# EAGLE schematic vdac (EAGLE 8.1.1)

## Sheet 1 of 4
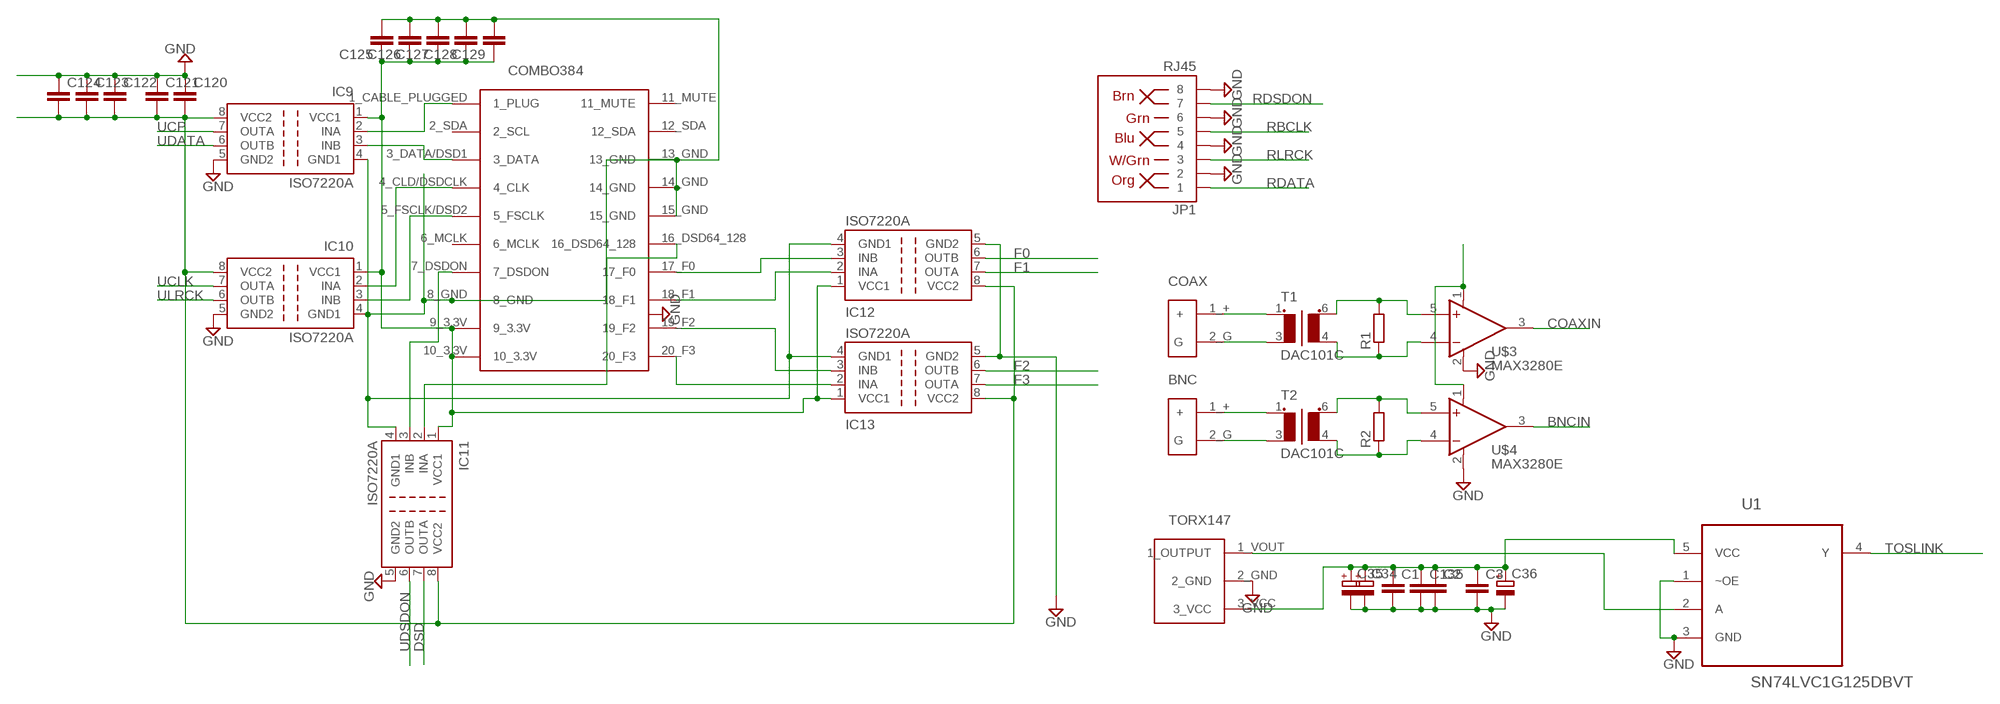
[diagram p0: schematic, sheet 1]

### Parts
BNC  RCA  [RCA]
C1  C-EUC0805  [C0805]
C2  C-EUC0805  [C0805]
C3  C-EUC0805  [C0805]
C34  CPOL-EUSP-CAP-CX  [SP-CAP-CX]
C35  CPOL-EUSP-CAP-CX  [SP-CAP-CX]
C36  CPOL-EUSP-CAP-CX  [SP-CAP-CX]
C120  C-EUC0805  [C0805]
C121  C-EUC0805  [C0805]
C122  C-EUC0805  [C0805]
C123  C-EUC0805  [C0805]
C124  C-EUC0805  [C0805]
C125  C-EUC0805  [C0805]
C126  C-EUC0805  [C0805]
C127  C-EUC0805  [C0805]
C128  C-EUC0805  [C0805]
C129  C-EUC0805  [C0805]
C135  C-EUC0805  [C0805]
COAX  RCA  [RCA]
IC9  ISO7220A  [SO-08]
IC10  ISO7220A  [SO-08]
IC11  ISO7220A  [SO-08]
IC12  ISO7220A  [SO-08]
IC13  ISO7220A  [SO-08]
JP1  RJ45  RJ45-8PTH  [RJ45-8]
R1  R-EU_MELF0204W  [MINI_MELF-0204W]
R2  R-EU_MELF0204W  [MINI_MELF-0204W]
T1  DAC101C  [DAC101]
T2  DAC101C  [DAC101]
U1  SN74LVC1G125DBVT  [SOT95P280X145-5N]
U$1  COMBO384  [COMBO384]
U$2  TORX147  [TORX147]
U$3  MAX3280E  [SOT23-5L]
U$4  MAX3280E  [SOT23-5L]

### Nets
BNCIN: U$4.3(OUT) ; also sheet 3
COAXIN: U$3.3(OUT) ; also sheet 3
DSD: IC11.7(OUTA) ; also sheet 3
F0: IC12.6(OUTB) ; also sheet 3
F1: IC12.7(OUTA) ; also sheet 3
F2: IC13.6(OUTB) ; also sheet 3
F3: IC13.7(OUTA) ; also sheet 3
GND: C1.2 C2.2 C3.2 C34.- C35.- C36.- C120.1 C121.1 C122.1 C123.1 C124.1 C135.2 IC9.5(GND2) IC10.5(GND2) IC11.5(GND2) IC12.5(GND2) IC13.5(GND2) JP1.2 JP1.4 JP1.6 JP1.8 U1.1(~OE) U1.3(GND) U$2.2_GND U$3.2(V-) U$4.2(V-) ; also sheet 2,3,4
I3V3: C1.1 C2.1 C3.1 C34.+ C35.+ C36.+ C120.2 C121.2 C122.2 C123.2 C124.2 C135.1 IC9.8(VCC2) IC10.8(VCC2) IC11.8(VCC2) IC12.8(VCC2) IC13.8(VCC2) U1.5(VCC) U$2.3_VCC U$3.1(V+) U$4.1(V+) ; also sheet 3
N$1: COAX.1_+(+) T1.1
N$2: COAX.2_G(G) T1.3(P2)
N$3: BNC.1_+(+) T2.1
N$4: BNC.2_G(G) T2.3(P2)
N$5: R1.2 T1.6(S1) U$3.5(+IN)
N$6: R1.1 T1.4(S2) U$3.4(-IN)
N$7: R2.2 T2.6(S1) U$4.5(+IN)
N$8: R2.1 T2.4(S2) U$4.4(-IN)
N$86: U1.2(A) U$2.1_VOUT(1_OUTPUT)
N$90: IC9.2(INA) U$1.1_CABLE_PLUGGED(1_PLUG)
N$93: IC9.3(INB) U$1.3_DATA/DSD1(3_DATA)
N$94: IC10.2(INA) U$1.4_CLD/DSDCLK(4_CLK)
N$95: IC10.3(INB) U$1.5_FSCLK/DSD2(5_FSCLK)
N$97: IC11.3(INB) U$1.7_DSDON
N$98: C125.1 C126.1 C127.1 C128.1 C129.1 IC9.1(VCC1) IC10.1(VCC1) IC11.1(VCC1) IC12.1(VCC1) IC13.1(VCC1) U$1.9_3.3V U$1.10_3.3V
N$99: IC11.2(INA) U$1.16_DSD64_128
N$100: IC12.3(INB) U$1.17_F0
N$101: IC12.2(INA) U$1.18_F1
N$102: IC13.3(INB) U$1.19_F2
N$103: IC13.2(INA) U$1.20_F3
RBCLK: JP1.5 ; also sheet 3
RDATA: JP1.1 ; also sheet 3
RDSDON: JP1.7 ; also sheet 3
RLRCK: JP1.3 ; also sheet 3
TOSLINK: U1.4(Y) ; also sheet 3
UCLK: IC10.7(OUTA) ; also sheet 3
UCP: IC9.7(OUTA)
UDATA: IC9.6(OUTB) ; also sheet 3
UDSDON: IC11.6(OUTB) ; also sheet 3
UGND: C125.2 C126.2 C127.2 C128.2 C129.2 IC9.4(GND1) IC10.4(GND1) IC11.4(GND1) IC12.4(GND1) IC13.4(GND1) U$1.8_GND U$1.13_GND U$1.14_GND U$1.15_GND
ULRCK: IC10.6(OUTB) ; also sheet 3
Unconnected: U$1.2_SDA(2_SCL) U$1.6_MCLK U$1.11_MUTE U$1.12_SDA

## Sheet 2 of 4
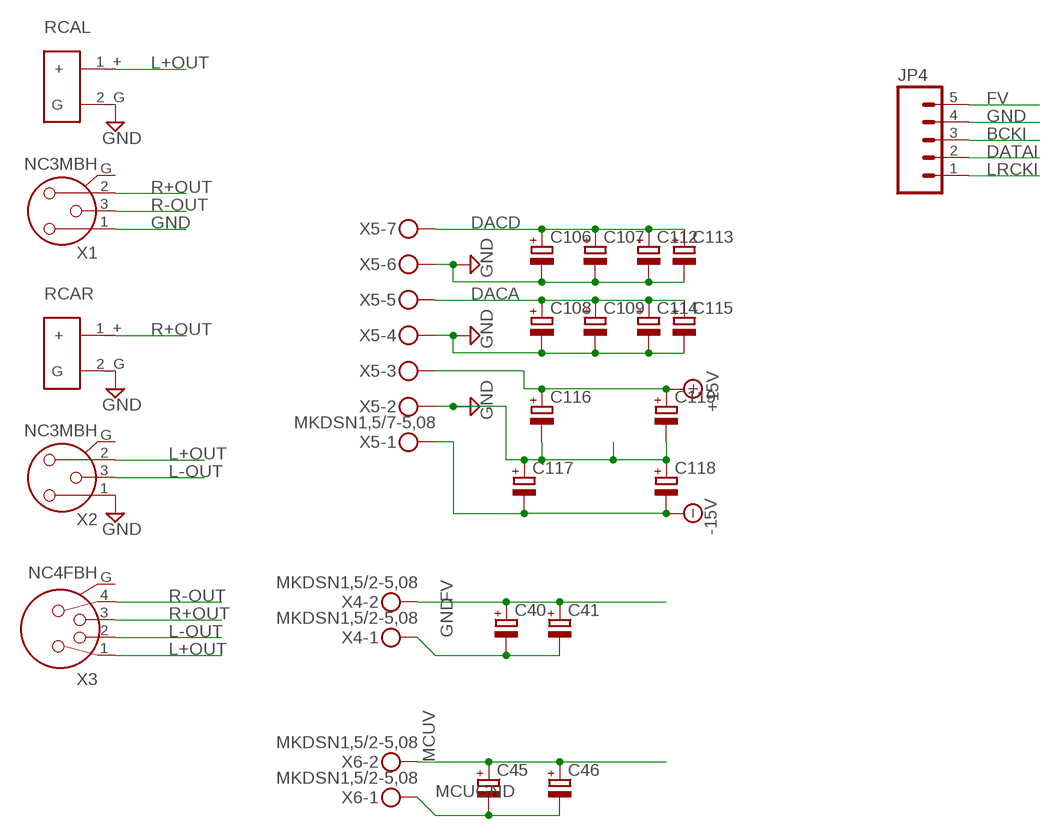
[diagram p1: schematic, sheet 2]

### Parts
C40  CPOL-EUSP-CAP-CX  [SP-CAP-CX]
C41  CPOL-EUSP-CAP-CX  [SP-CAP-CX]
C45  CPOL-EUSP-CAP-CX  [SP-CAP-CX]
C46  CPOL-EUSP-CAP-CX  [SP-CAP-CX]
C106  CPOL-EUSP-CAP-CX  [SP-CAP-CX]
C107  CPOL-EUSP-CAP-CX  [SP-CAP-CX]
C108  CPOL-EUSP-CAP-CX  [SP-CAP-CX]
C109  CPOL-EUSP-CAP-CX  [SP-CAP-CX]
C112  CPOL-EUSP-CAP-CX  [SP-CAP-CX]
C113  CPOL-EUSP-CAP-CX  [SP-CAP-CX]
C114  CPOL-EUSP-CAP-CX  [SP-CAP-CX]
C115  CPOL-EUSP-CAP-CX  [SP-CAP-CX]
C116  CPOL-EUSP-CAP-CX  [SP-CAP-CX]
C117  CPOL-EUSP-CAP-CX  [SP-CAP-CX]
C118  CPOL-EUSP-CAP-CX  [SP-CAP-CX]
C119  CPOL-EUSP-CAP-CX  [SP-CAP-CX]
JP4  M05PTH_LONGPADS  [1X05_LONGPADS]
RCAL  RCA  [RCA]
RCAR  RCA  [RCA]
X1  NC3MBH  [NC3MBH]
X2  NC3MBH  [NC3MBH]
X3  NC4FBH  [NC4FBH]
X4  MKDSN1,5/2-5,08  [MKDSN1,5/2-5,08]
X5  MKDSN1,5/7-5,08  [MKDSN1,5/7-5,08]
X6  MKDSN1,5/2-5,08  [MKDSN1,5/2-5,08]

### Nets
+15V: C116.+ C119.+ X5.3 ; also sheet 4
-15V: C117.- C118.- X5.1 ; also sheet 4
BCKI: JP4.3 ; also sheet 3
DACA: C108.+ C109.+ C114.+ C115.+ X5.5 ; also sheet 4
DACD: C106.+ C107.+ C112.+ C113.+ X5.7 ; also sheet 4
DATAI: JP4.2 ; also sheet 3
FV: C40.+ C41.+ JP4.5 X4.2 ; also sheet 3,4
GND: C40.- C41.- C106.- C107.- C108.- C109.- C112.- C113.- C114.- C115.- C116.- C117.+ C118.+ C119.- JP4.4 RCAL.2_G(G) RCAR.2_G(G) X1.1 X2.1 X4.1 X5.2 X5.4 X5.6 ; also sheet 1,3,4
L+OUT: RCAL.1_+(+) X2.2 X3.1 ; also sheet 4
L-OUT: X2.3 X3.2 ; also sheet 4
LRCKI: JP4.1 ; also sheet 3
MCUGND: C45.- C46.- X6.1 ; also sheet 3
MCUV: C45.+ C46.+ X6.2 ; also sheet 3
R+OUT: RCAR.1_+(+) X1.2 X3.3 ; also sheet 4
R-OUT: X1.3 X3.4 ; also sheet 4
Unconnected: X1.G X2.G X3.G

## Sheet 3 of 4
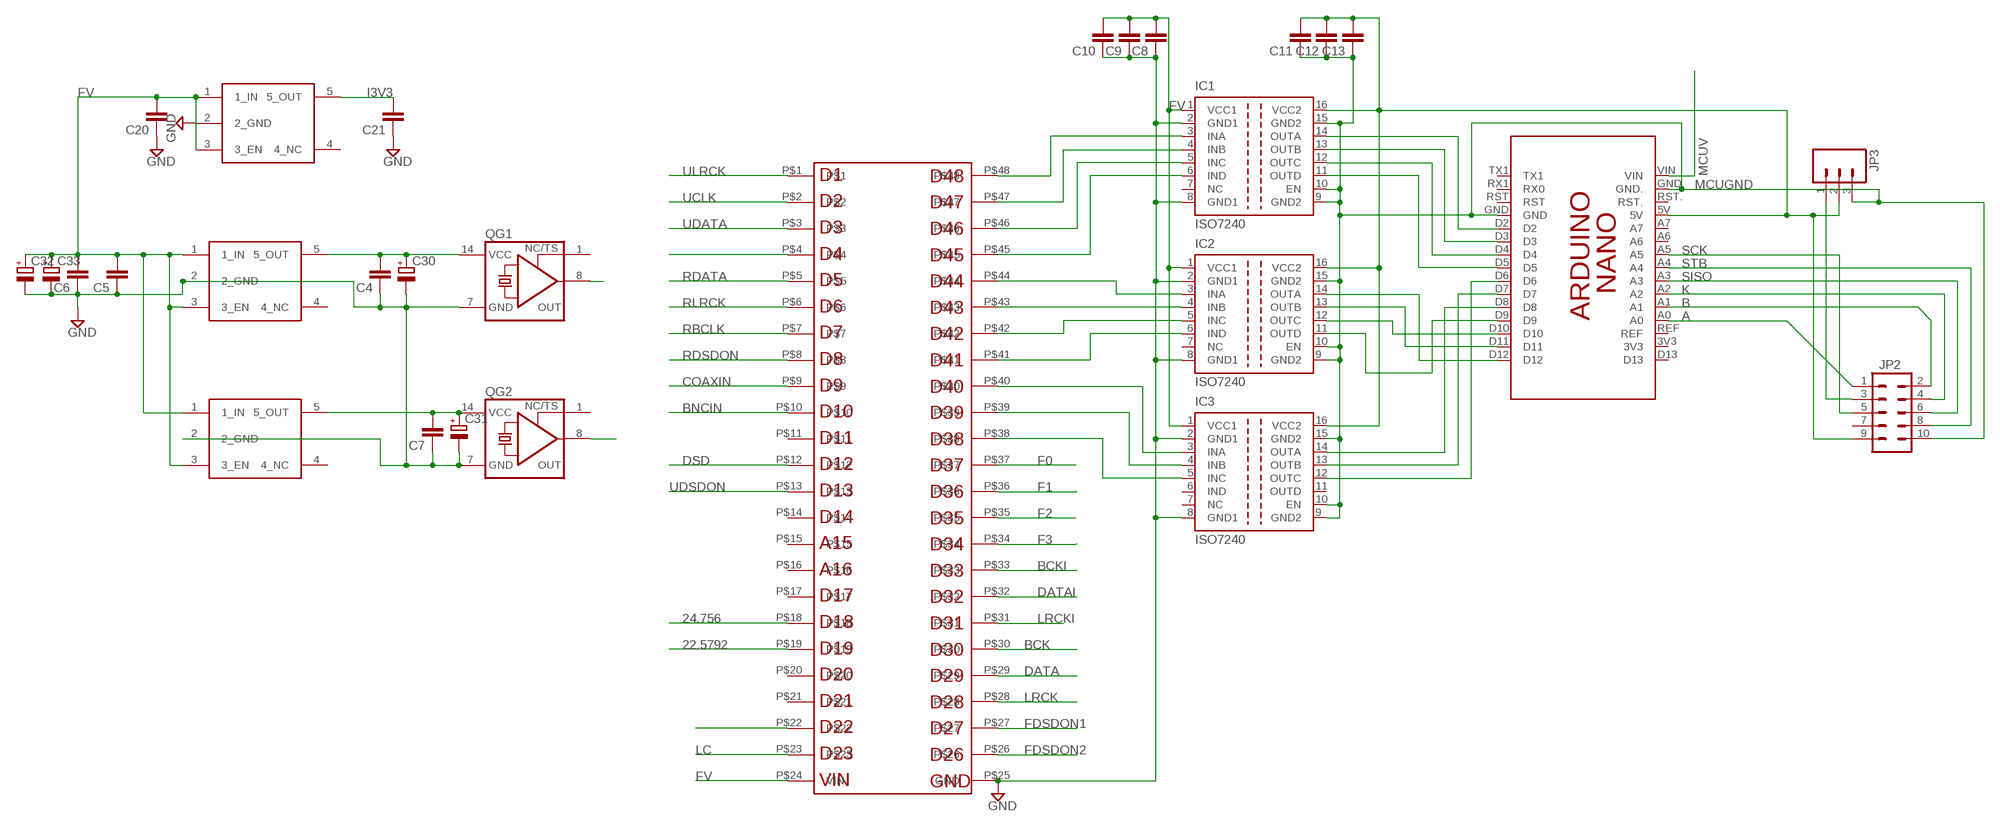
[diagram p2: schematic, sheet 3]

### Parts
C4  C-EUC0805  [C0805]
C5  C-EUC0805  [C0805]
C6  C-EUC0805  [C0805]
C7  C-EUC0805  [C0805]
C8  C-EUC0805  [C0805]
C9  C-EUC0805  [C0805]
C10  C-EUC0805  [C0805]
C11  C-EUC0805  [C0805]
C12  C-EUC0805  [C0805]
C13  C-EUC0805  [C0805]
C20  C-EUC0805  [C0805]
C21  C-EUC0805  [C0805]
C30  CPOL-EUSP-CAP-CX  [SP-CAP-CX]
C31  CPOL-EUSP-CAP-CX  [SP-CAP-CX]
C32  CPOL-EUSP-CAP-CX  [SP-CAP-CX]
C33  CPOL-EUSP-CAP-CX  [SP-CAP-CX]
IC1  ISO7240  [SO-16DW]
IC2  ISO7240  [SO-16DW]
IC3  ISO7240  [SO-16DW]
JP2  M05X2SHD  [2X5-SHROUDED]
JP3  M03JST-PTH-VERT  [JST-3-PTH-VERT]
PCB1  ARDUINO_NANO  [ARDUINO_NANO]
QG1  XO-14  [DIL14S]
QG2  XO-14  [DIL14S]
U$10  LP5907  [SOT-23-5]
U$12  CMOD-A7  [CMODA7]
U$15  LP5907  [SOT-23-5]
U$16  LP5907  [SOT-23-5]

### Nets
22.5792: QG2.8(OUT) U$12.P$19
24.756: QG1.8(OUT) U$12.P$18
A: JP2.1 PCB1.A0
B: JP2.2 PCB1.A1
BCK: U$12.P$30 ; also sheet 4
BCKI: U$12.P$33 ; also sheet 2
BNCIN: U$12.P$10 ; also sheet 1
COAXIN: U$12.P$9 ; also sheet 1
D2: IC1.14(OUTA) PCB1.D2
D3: IC1.13(OUTB) PCB1.D3
D4: IC1.12(OUTC) PCB1.D4
D5: IC1.11(OUTD) PCB1.D5
DATA: U$12.P$29 ; also sheet 4
DATAI: U$12.P$32 ; also sheet 2
DSD: U$12.P$12 ; also sheet 1
F0: U$12.P$37 ; also sheet 1
F1: U$12.P$36 ; also sheet 1
F2: U$12.P$35 ; also sheet 1
F3: U$12.P$34 ; also sheet 1
FDSDON1: U$12.P$27 ; also sheet 4
FDSDON2: U$12.P$26 ; also sheet 4
FV: C5.2 C6.2 C8.2 C9.2 C10.2 C20.2 C32.+ C33.+ IC1.1(VCC1) IC2.1(VCC1) IC3.1(VCC1) U$10.1(1_IN) U$10.3(3_EN) U$12.P$24(VIN) U$15.1(1_IN) U$15.3(3_EN) U$16.1(1_IN) U$16.3(3_EN) ; also sheet 2,4
GND: C4.1 C5.1 C6.1 C7.1 C8.1 C9.1 C10.1 C20.1 C21.1 C30.- C31.- C32.- C33.- IC1.2(GND1) IC1.8(GND1) IC2.2(GND1) IC2.8(GND1) IC3.2(GND1) IC3.8(GND1) QG1.7(GND) QG2.7(GND) U$10.2(2_GND) U$12.P$25(GND) U$15.2(2_GND) U$16.2(2_GND) ; also sheet 1,2,4
I3V3: C21.2 U$10.5(5_OUT) ; also sheet 1
K: JP2.4 PCB1.A2
LC: U$12.P$23 ; also sheet 4
LRCK: U$12.P$28 ; also sheet 4
LRCKI: U$12.P$31 ; also sheet 2
MCUGND: C11.1 C12.1 C13.1 IC1.9(GND2) IC1.10(EN) IC1.15(GND2) IC2.9(GND2) IC2.10(EN) IC2.15(GND2) IC3.9(GND2) IC3.10(EN) IC3.15(GND2) JP2.10 JP3.3 PCB1.GND PCB1.GND. ; also sheet 2
MCUV: PCB1.VIN ; also sheet 2
N$25: C4.2 C30.+ QG1.14(VCC) U$15.5(5_OUT)
N$27: C7.2 C31.+ QG2.14(VCC) U$16.5(5_OUT)
N$32: IC1.3(INA) U$12.P$48
N$33: IC1.4(INB) U$12.P$47
N$35: IC1.5(INC) U$12.P$46
N$36: IC1.6(IND) U$12.P$45
N$39: IC2.3(INA) U$12.P$44
N$40: IC2.4(INB) U$12.P$43
N$42: IC2.5(INC) U$12.P$42
N$43: IC2.6(IND) U$12.P$41
N$44: IC3.3(INA) U$12.P$40
N$45: IC3.4(INB) U$12.P$39
N$46: IC3.5(INC) U$12.P$38
N$51: IC2.14(OUTA) PCB1.D12
N$52: IC2.13(OUTB) PCB1.D11
N$53: IC2.12(OUTC) PCB1.D10
N$54: IC2.11(OUTD) PCB1.D9
N$55: IC3.14(OUTA) PCB1.D8
N$56: IC3.13(OUTB) PCB1.D7
N$57: IC3.12(OUTC) PCB1.D6
N$91: C11.2 C12.2 C13.2 IC1.16(VCC2) IC2.16(VCC2) IC3.16(VCC2) JP2.9 JP3.2 PCB1.5V
N$92: JP2.3 JP3.1
RBCLK: U$12.P$7 ; also sheet 1
RC: U$12.P$22 ; also sheet 4
RDATA: U$12.P$5 ; also sheet 1
RDSDON: U$12.P$8 ; also sheet 1
RLRCK: U$12.P$6 ; also sheet 1
SCK: JP2.5 PCB1.A5
SISO: JP2.6 PCB1.A3
STB: JP2.8 PCB1.A4
TOSLINK: U$12.P$4 ; also sheet 1
UCLK: U$12.P$2 ; also sheet 1
UDATA: U$12.P$3 ; also sheet 1
UDSDON: U$12.P$13 ; also sheet 1
ULRCK: U$12.P$1 ; also sheet 1
Unconnected: IC1.7(NC) IC2.7(NC) IC3.6(IND) IC3.7(NC) IC3.11(OUTD) JP2.7 PCB1.3V3 PCB1.A6 PCB1.A7 PCB1.D13 PCB1.REF PCB1.RST PCB1.RST. PCB1.RX1(RX0) PCB1.TX1 QG1.1(TS) QG2.1(TS) U$10.4(4_NC) U$12.P$11 U$12.P$14 U$12.P$15 U$12.P$16 U$12.P$17 U$12.P$20 U$12.P$21 U$15.4(4_NC) U$16.4(4_NC)

## Sheet 4 of 4
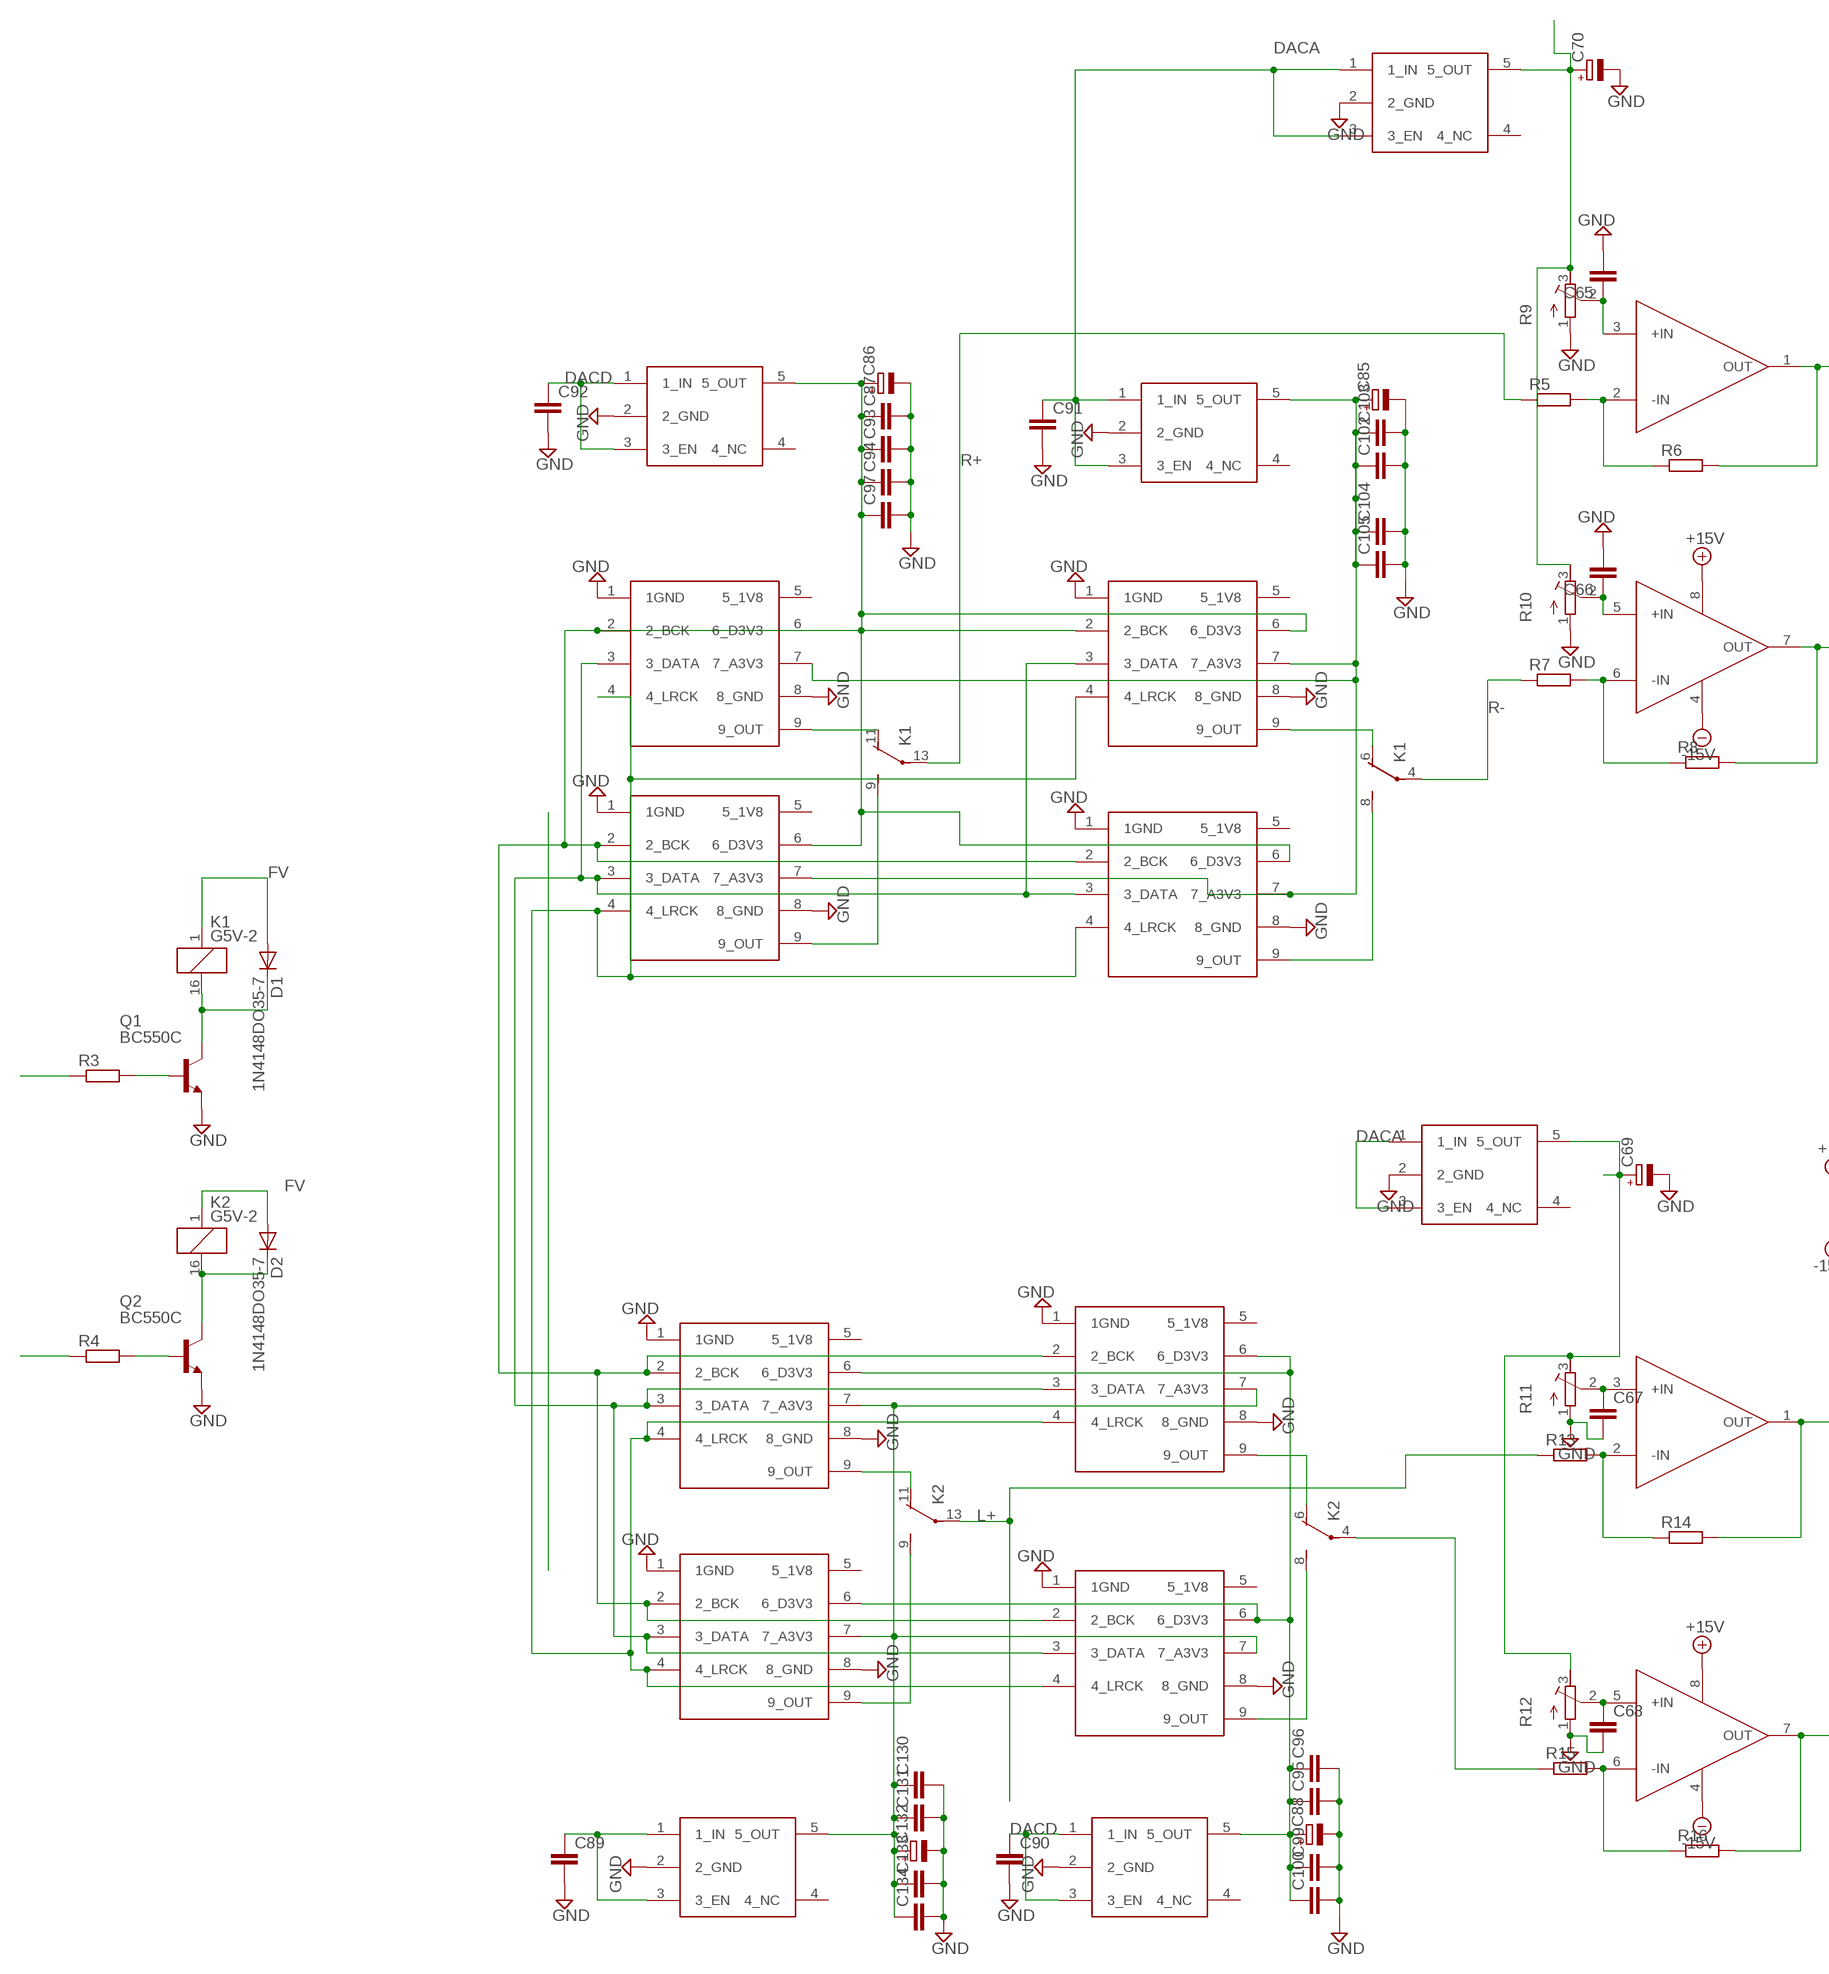
[diagram p3: schematic, sheet 4, part 1 of 2]
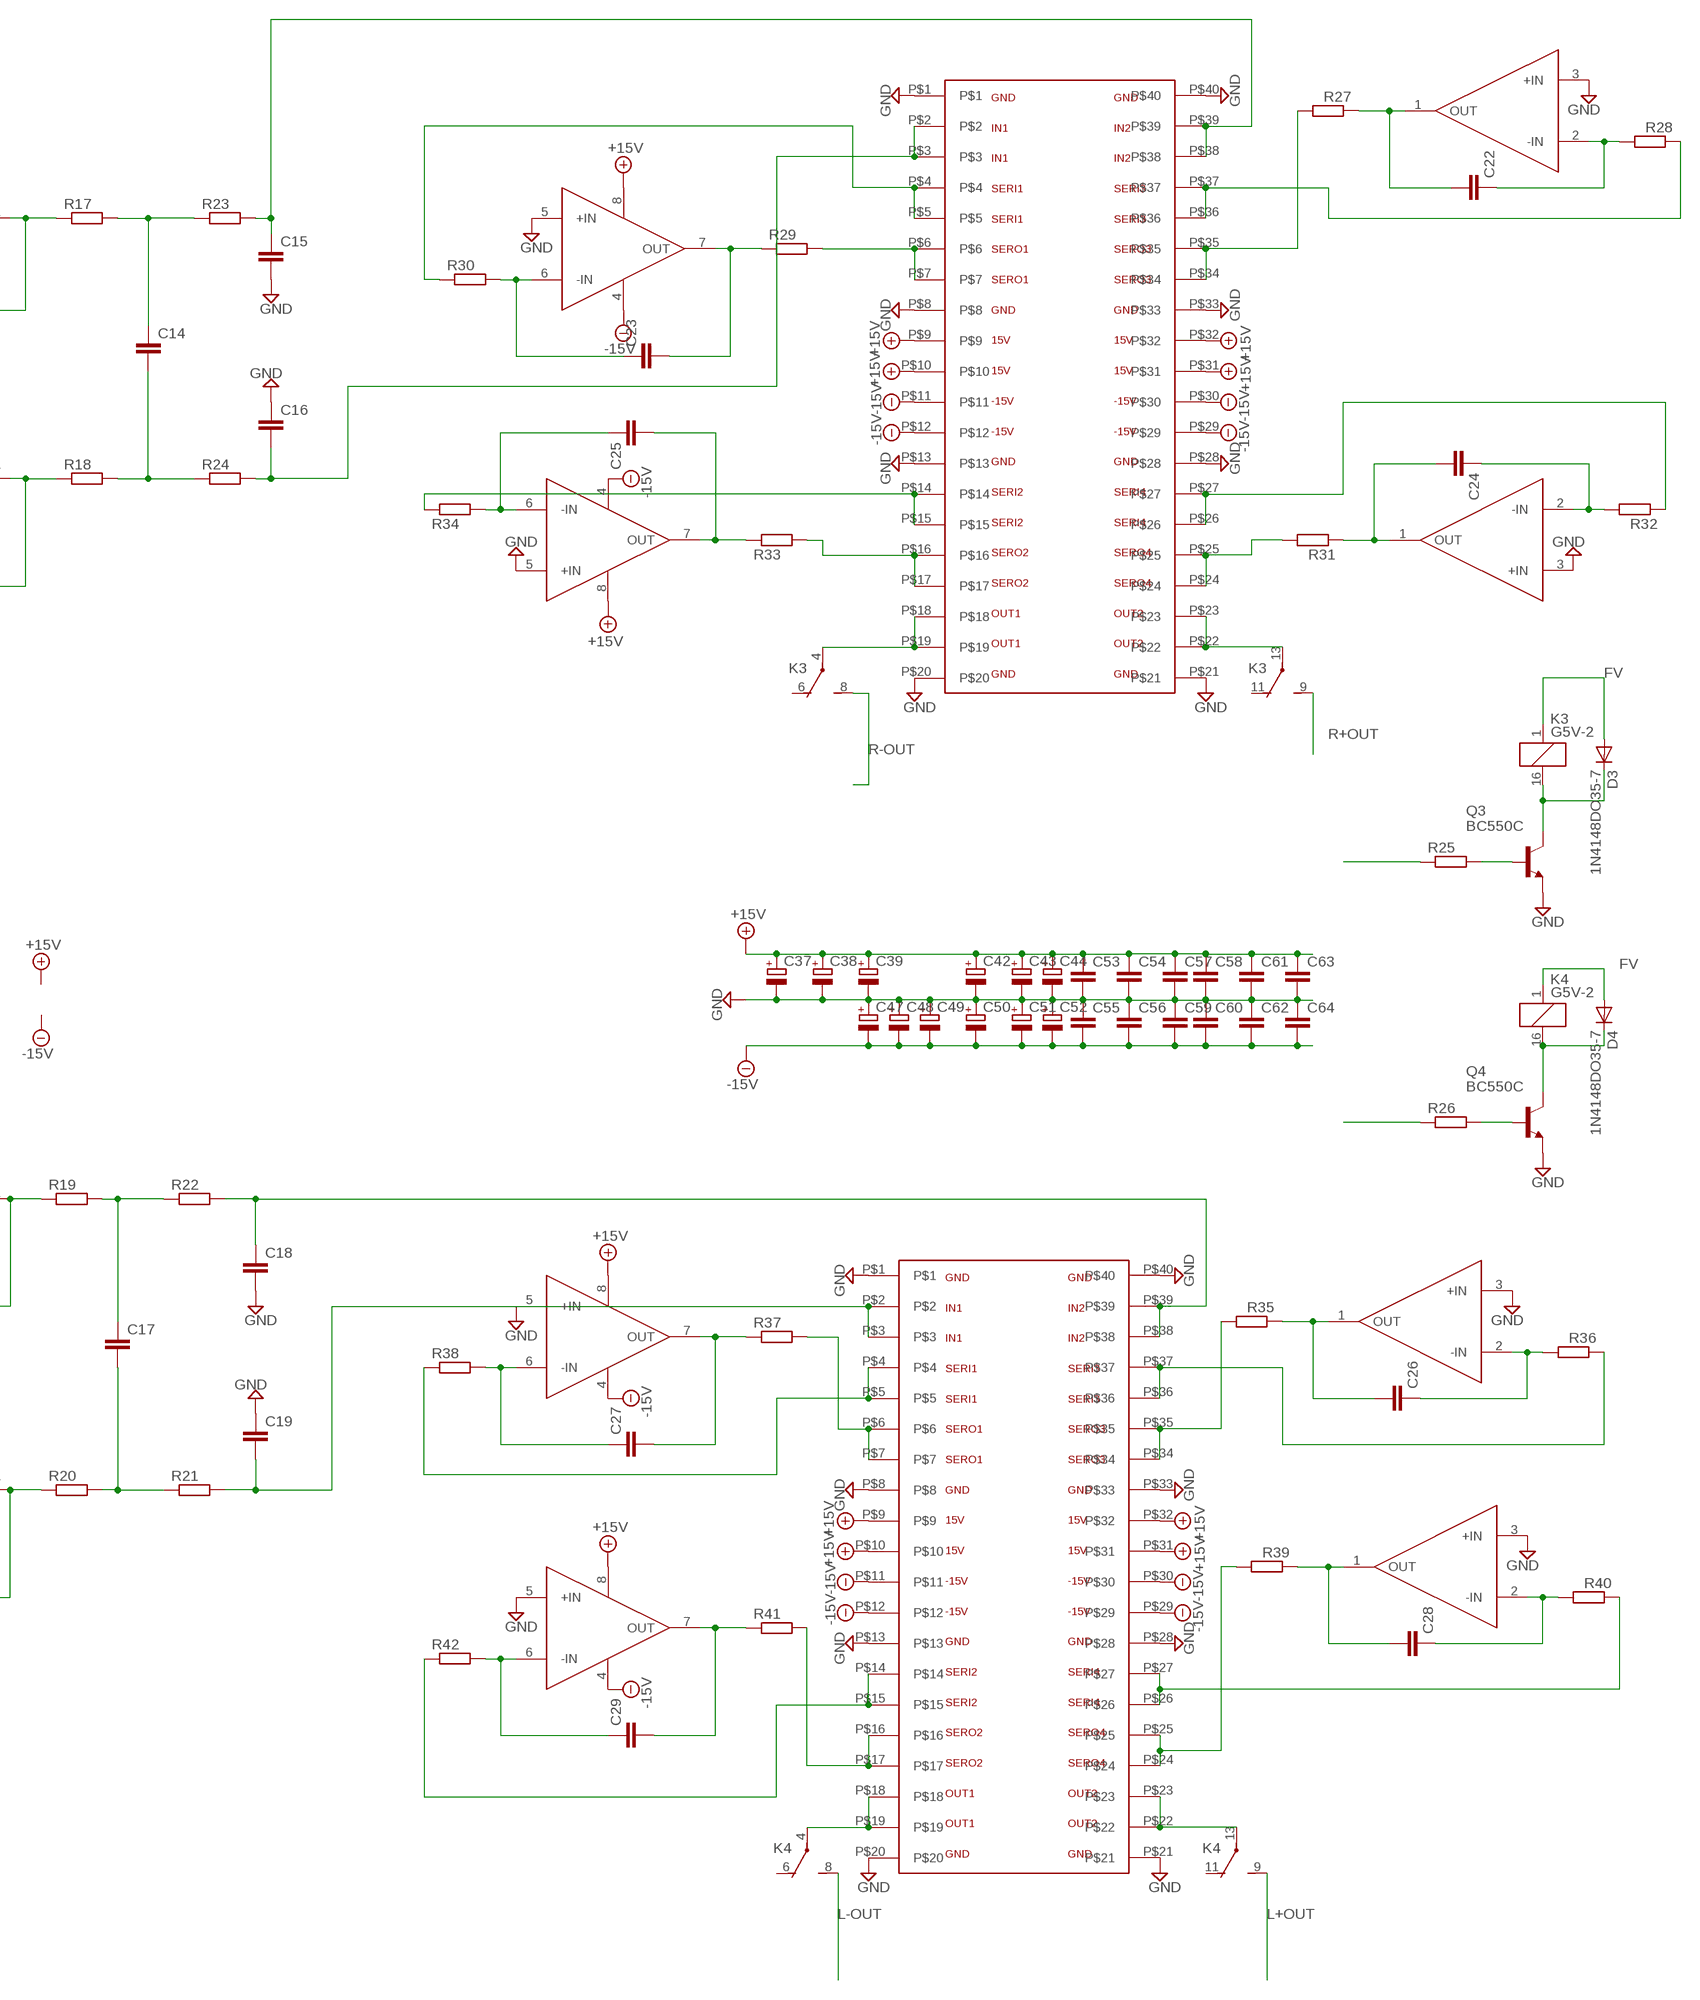
[diagram p4: schematic, sheet 4, part 2 of 2]

### Parts
C14  C-EUC0805  [C0805]
C15  C-EUC0805  [C0805]
C16  C-EUC0805  [C0805]
C17  C-EUC0805  [C0805]
C18  C-EUC0805  [C0805]
C19  C-EUC0805  [C0805]
C22  C-EUC1210  [C1210]
C23  C-EUC1210  [C1210]
C24  C-EUC1210  [C1210]
C25  C-EUC1210  [C1210]
C26  C-EUC1210  [C1210]
C27  C-EUC1210  [C1210]
C28  C-EUC1210  [C1210]
C29  C-EUC1210  [C1210]
C37  CPOL-EUSP-CAP-CX  [SP-CAP-CX]
C38  CPOL-EUSP-CAP-CX  [SP-CAP-CX]
C39  CPOL-EUSP-CAP-CX  [SP-CAP-CX]
C42  CPOL-EUSP-CAP-CX  [SP-CAP-CX]
C43  CPOL-EUSP-CAP-CX  [SP-CAP-CX]
C44  CPOL-EUSP-CAP-CX  [SP-CAP-CX]
C47  CPOL-EUSP-CAP-CX  [SP-CAP-CX]
C48  CPOL-EUSP-CAP-CX  [SP-CAP-CX]
C49  CPOL-EUSP-CAP-CX  [SP-CAP-CX]
C50  CPOL-EUSP-CAP-CX  [SP-CAP-CX]
C51  CPOL-EUSP-CAP-CX  [SP-CAP-CX]
C52  CPOL-EUSP-CAP-CX  [SP-CAP-CX]
C53  C-EUC1206  [C1206]
C54  C-EUC1206  [C1206]
C55  C-EUC1206  [C1206]
C56  C-EUC1206  [C1206]
C57  C-EUC1206  [C1206]
C58  C-EUC1206  [C1206]
C59  C-EUC1206  [C1206]
C60  C-EUC1206  [C1206]
C61  C-EUC1206  [C1206]
C62  C-EUC1206  [C1206]
C63  C-EUC1206  [C1206]
C64  C-EUC1206  [C1206]
C65  C-EUC1210  [C1210]
C66  C-EUC1210  [C1210]
C67  C-EUC1210  [C1210]
C68  C-EUC1210  [C1210]
C69  CPOL-EUSP-CAP-CX  [SP-CAP-CX]
C70  CPOL-EUSP-CAP-CX  [SP-CAP-CX]
C85  CPOL-EUSP-CAP-CX  [SP-CAP-CX]
C86  CPOL-EUSP-CAP-CX  [SP-CAP-CX]
C87  C-EUC1210  [C1210]
C88  CPOL-EUSP-CAP-CX  [SP-CAP-CX]
C89  C-EUC1210  [C1210]
C90  C-EUC1210  [C1210]
C91  C-EUC1210  [C1210]
C92  C-EUC1210  [C1210]
C93  C-EUC1210  [C1210]
C94  C-EUC1210  [C1210]
C95  C-EUC1210  [C1210]
C96  C-EUC1210  [C1210]
C97  C-EUC1210  [C1210]
C99  C-EUC1210  [C1210]
C100  C-EUC1210  [C1210]
C102  C-EUC1210  [C1210]
C103  C-EUC1210  [C1210]
C104  C-EUC1210  [C1210]
C105  C-EUC1210  [C1210]
C130  C-EUC1210  [C1210]
C131  C-EUC1210  [C1210]
C132  CPOL-EUSP-CAP-CX  [SP-CAP-CX]
C133  C-EUC1210  [C1210]
C134  C-EUC1210  [C1210]
D1  1N4148DO35-7  [DO35-7]
D2  1N4148DO35-7  [DO35-7]
D3  1N4148DO35-7  [DO35-7]
D4  1N4148DO35-7  [DO35-7]
DSDL+  R2R  [R2R]
DSDL-  R2R  [R2R]
DSDR+  R2R  [R2R]
DSDR-  R2R  [R2R]
K1  G5V-2  [G5V-2]
K2  G5V-2  [G5V-2]
K3  G5V-2  [G5V-2]
K4  G5V-2  [G5V-2]
L+  R2R  [R2R]
L-  R2R  [R2R]
Q1  BC550C  [TO92-EBC]
Q2  BC550C  [TO92-EBC]
Q3  BC550C  [TO92-EBC]
Q4  BC550C  [TO92-EBC]
R3  R-EU_MELF0204W  [MINI_MELF-0204W]
R4  R-EU_MELF0204W  [MINI_MELF-0204W]
R5  R-EU_MELF0204W  [MINI_MELF-0204W]
R6  R-EU_MELF0204W  [MINI_MELF-0204W]
R7  R-EU_MELF0204W  [MINI_MELF-0204W]
R8  R-EU_MELF0204W  [MINI_MELF-0204W]
R9  R-TRIMM3296W  [RTRIM3296W]
R10  R-TRIMM3296W  [RTRIM3296W]
R11  R-TRIMM3296W  [RTRIM3296W]
R12  R-TRIMM3296W  [RTRIM3296W]
R13  R-EU_MELF0204W  [MINI_MELF-0204W]
R14  R-EU_MELF0204W  [MINI_MELF-0204W]
R15  R-EU_MELF0204W  [MINI_MELF-0204W]
R16  R-EU_MELF0204W  [MINI_MELF-0204W]
R17  R-EU_MELF0204W  [MINI_MELF-0204W]
R18  R-EU_MELF0204W  [MINI_MELF-0204W]
R19  R-EU_MELF0204W  [MINI_MELF-0204W]
R20  R-EU_MELF0204W  [MINI_MELF-0204W]
R21  R-EU_MELF0204W  [MINI_MELF-0204W]
R22  R-EU_MELF0204W  [MINI_MELF-0204W]
R23  R-EU_MELF0204W  [MINI_MELF-0204W]
R24  R-EU_MELF0204W  [MINI_MELF-0204W]
R25  R-EU_MELF0204W  [MINI_MELF-0204W]
R26  R-EU_MELF0204W  [MINI_MELF-0204W]
R27  R-EU_MELF0204W  [MINI_MELF-0204W]
R28  R-EU_MELF0204W  [MINI_MELF-0204W]
R29  R-EU_MELF0204W  [MINI_MELF-0204W]
R30  R-EU_MELF0204W  [MINI_MELF-0204W]
R31  R-EU_MELF0204W  [MINI_MELF-0204W]
R32  R-EU_MELF0204W  [MINI_MELF-0204W]
R33  R-EU_MELF0204W  [MINI_MELF-0204W]
R34  R-EU_MELF0204W  [MINI_MELF-0204W]
R35  R-EU_MELF0204W  [MINI_MELF-0204W]
R36  R-EU_MELF0204W  [MINI_MELF-0204W]
R37  R-EU_MELF0204W  [MINI_MELF-0204W]
R38  R-EU_MELF0204W  [MINI_MELF-0204W]
R39  R-EU_MELF0204W  [MINI_MELF-0204W]
R40  R-EU_MELF0204W  [MINI_MELF-0204W]
R41  R-EU_MELF0204W  [MINI_MELF-0204W]
R42  R-EU_MELF0204W  [MINI_MELF-0204W]
R+  R2R  [R2R]
R-  R2R  [R2R]
U$5  LME49720  [DIL08]
U$6  LME49720  [DIL08]
U$7  LP5907  [SOT-23-5]
U$8  LP5907  [SOT-23-5]
U$9  VDACA  [VDACA]
U$11  VDACA  [VDACA]
U$13  LME49720  [DIL08]
U$14  LME49720  [DIL08]
U$17  LP5907  [SOT-23-5]
U$18  LP5907  [SOT-23-5]
U$19  LP5907  [SOT-23-5]
U$20  LP5907  [SOT-23-5]
U$21  LME49720  [DIL08]
U$22  LME49720  [DIL08]

### Nets
+15V: C37.+ C38.+ C39.+ C42.+ C43.+ C44.+ C53.1 C54.1 C57.1 C58.1 C61.1 C63.1 U$5.8(V+) U$6.8(V+) U$9.P$9 U$9.P$10 U$9.P$31 U$9.P$32 U$11.P$9 U$11.P$10 U$11.P$31 U$11.P$32 U$13.8(V+) U$14.8(V+) U$21.8(V+) U$22.8(V+) ; also sheet 2
-15V: C47.- C48.- C49.- C50.- C51.- C52.- C55.2 C56.2 C59.2 C60.2 C62.2 C64.2 U$5.4(V-) U$6.4(V-) U$9.P$11 U$9.P$12 U$9.P$29 U$9.P$30 U$11.P$11 U$11.P$12 U$11.P$29 U$11.P$30 U$13.4(V-) U$14.4(V-) U$21.4(V-) U$22.4(V-) ; also sheet 2
BCK: DSDL+.2(2_BCK) DSDL-.2(2_BCK) DSDR+.2(2_BCK) DSDR-.2(2_BCK) L+.2(2_BCK) L-.2(2_BCK) R+.2(2_BCK) R-.2(2_BCK) ; also sheet 3
DACA: C89.1 C91.1 U$7.1(1_IN) U$7.3(3_EN) U$8.1(1_IN) U$8.3(3_EN) U$18.1(1_IN) U$18.3(3_EN) U$19.1(1_IN) U$19.3(3_EN) ; also sheet 2
DACD: C90.1 C92.1 U$17.1(1_IN) U$17.3(3_EN) U$20.1(1_IN) U$20.3(3_EN) ; also sheet 2
DATA: DSDL+.3(3_DATA) DSDL-.3(3_DATA) DSDR+.3(3_DATA) DSDR-.3(3_DATA) L+.3(3_DATA) L-.3(3_DATA) R+.3(3_DATA) R-.3(3_DATA) ; also sheet 3
FDSDON1: R3.1 ; also sheet 3
FDSDON2: R4.1 ; also sheet 3
FV: D1.A D2.A D3.A D4.A K1.1 K2.1 K3.1 K4.1 ; also sheet 2,3
GND: C15.2 C16.1 C18.2 C19.1 C37.- C38.- C39.- C42.- C43.- C44.- C47.+ C48.+ C49.+ C50.+ C51.+ C52.+ C53.2 C54.2 C55.1 C56.1 C57.2 C58.2 C59.1 C60.1 C61.2 C62.1 C63.2 C64.1 C65.2 C66.2 C67.2 C68.2 C69.- C70.- C85.- C86.- C87.2 C88.- C89.2 C90.2 C91.2 C92.2 C93.2 C94.2 C95.2 C96.2 C97.2 C99.2 C100.2 C102.2 C103.2 C104.2 C105.2 C130.2 C131.2 C132.- C133.2 C134.2 DSDL+.1(1GND) DSDL+.8(8_GND) DSDL-.1(1GND) DSDL-.8(8_GND) DSDR+.1(1GND) DSDR+.8(8_GND) DSDR-.1(1GND) DSDR-.8(8_GND) L+.1(1GND) L+.8(8_GND) L-.1(1GND) L-.8(8_GND) Q1.E Q2.E Q3.E Q4.E R9.1(A) R10.1(A) R11.1(A) R12.1(A) R+.1(1GND) R+.8(8_GND) R-.1(1GND) R-.8(8_GND) U$7.2(2_GND) U$8.2(2_GND) U$9.P$1 U$9.P$8 U$9.P$13 U$9.P$20 U$9.P$21 U$9.P$28 U$9.P$33 U$9.P$40 U$11.P$1 U$11.P$8 U$11.P$13 U$11.P$20 U$11.P$21 U$11.P$28 U$11.P$33 U$11.P$40 U$13.3(+IN) U$13.5(+IN) U$14.3(+IN) U$14.5(+IN) U$17.2(2_GND) U$18.2(2_GND) U$19.2(2_GND) U$20.2(2_GND) U$21.3(+IN) U$21.5(+IN) U$22.3(+IN) U$22.5(+IN) ; also sheet 1,2,3
L+: K2.13(2:P) R13.1
L+OUT: K4.9(2:S) ; also sheet 2
L-: K2.4(1:P) R15.1
L-OUT: K4.8(1:S) ; also sheet 2
LC: R26.1 ; also sheet 3
LRCK: DSDL+.4(4_LRCK) DSDL-.4(4_LRCK) DSDR+.4(4_LRCK) DSDR-.4(4_LRCK) L+.4(4_LRCK) L-.4(4_LRCK) R+.4(4_LRCK) R-.4(4_LRCK) ; also sheet 3
N$10: K1.11(2:O) R+.9(9_OUT)
N$11: DSDR+.9(9_OUT) K1.9(2:S)
N$12: K1.6(1:O) R-.9(9_OUT)
N$13: DSDR-.9(9_OUT) K1.8(1:S)
N$14: K2.11(2:O) L+.9(9_OUT)
N$15: K2.6(1:O) L-.9(9_OUT)
N$16: DSDL-.9(9_OUT) K2.8(1:S)
N$17: DSDL+.9(9_OUT) K2.9(2:S)
N$26: Q1.B R3.2
N$28: Q2.B R4.2
N$29: C130.1 C131.1 C132.+ C133.1 C134.1 DSDL+.7(7_A3V3) DSDL-.7(7_A3V3) L+.7(7_A3V3) L-.7(7_A3V3) U$19.5(5_OUT)
N$30: C85.+ C102.1 C103.1 C104.1 C105.1 DSDR+.7(7_A3V3) DSDR-.7(7_A3V3) R+.7(7_A3V3) R-.7(7_A3V3) U$18.5(5_OUT)
N$31: C86.+ C87.1 C93.1 C94.1 C97.1 DSDR+.6(6_D3V3) DSDR-.6(6_D3V3) R+.6(6_D3V3) R-.6(6_D3V3) U$17.5(5_OUT)
N$34: C88.+ C95.1 C96.1 C99.1 C100.1 DSDL+.6(6_D3V3) DSDL-.6(6_D3V3) L+.6(6_D3V3) L-.6(6_D3V3) U$20.5(5_OUT)
N$37: R7.2 R8.1 U$5.6(-IN)
N$38: D2.C K2.16 Q2.C
N$41: D1.C K1.16 Q1.C
N$47: R8.2 R18.1 U$5.7(OUT)
N$48: R5.2 R6.1 U$5.2(-IN)
N$49: R6.2 R17.1 U$5.1(OUT)
N$50: C67.1 R11.2(S) U$6.3(+IN)
N$58: C65.1 R9.2(S) U$5.3(+IN)
N$59: C66.1 R10.2(S) U$5.5(+IN)
N$60: C70.+ R9.3(E) R10.3(E) U$7.5(5_OUT)
N$61: C68.1 R12.2(S) U$6.5(+IN)
N$62: C69.+ R11.3(E) R12.3(E) U$8.5(5_OUT)
N$63: R13.2 R14.1 U$6.2(-IN)
N$64: R15.2 R16.1 U$6.6(-IN)
N$65: C17.1 R19.2 R22.1
N$66: R16.2 R20.1 U$6.7(OUT)
N$67: R14.2 R19.1 U$6.1(OUT)
N$68: C17.2 R20.2 R21.1
N$69: C18.1 R22.2 U$9.P$38 U$9.P$39
N$70: C19.2 R21.2 U$9.P$2 U$9.P$3
N$71: C14.2 R18.2 R24.1
N$72: C16.2 R24.2 U$11.P$2 U$11.P$3
N$73: C14.1 R17.2 R23.1
N$74: C15.1 R23.2 U$11.P$38 U$11.P$39
N$75: Q3.B R25.2
N$76: Q4.B R26.2
N$77: D4.C K4.16 Q4.C
N$78: D3.C K3.16 Q3.C
N$79: C22.1 R28.2 U$13.2(-IN)
N$80: C23.1 R30.2 U$13.6(-IN)
N$81: C23.2 R29.1 U$13.7(OUT)
N$82: C22.2 R27.1 U$13.1(OUT)
N$83: C24.1 R32.2 U$14.2(-IN)
N$84: C25.1 R34.2 U$14.6(-IN)
N$85: C25.2 R33.1 U$14.7(OUT)
N$87: C24.2 R31.1 U$14.1(OUT)
N$88: C26.1 R36.2 U$21.2(-IN)
N$104: C27.1 R38.2 U$21.6(-IN)
N$105: C27.2 R37.1 U$21.7(OUT)
N$106: C26.2 R35.1 U$21.1(OUT)
N$107: C28.1 R40.2 U$22.2(-IN)
N$108: C29.1 R42.2 U$22.6(-IN)
N$109: C29.2 R41.1 U$22.7(OUT)
N$110: C28.2 R39.1 U$22.1(OUT)
N$111: K4.4(1:P) U$9.P$18 U$9.P$19
N$112: R29.2 U$11.P$6 U$11.P$7
N$113: R33.2 U$11.P$16 U$11.P$17
N$114: R34.1 U$11.P$14 U$11.P$15
N$115: R30.1 U$11.P$4 U$11.P$5
N$116: R27.2 U$11.P$34 U$11.P$35
N$117: R28.1 U$11.P$36 U$11.P$37
N$118: R31.2 U$11.P$24 U$11.P$25
N$119: R32.1 U$11.P$26 U$11.P$27
N$120: R41.2 U$9.P$16 U$9.P$17
N$121: R42.1 U$9.P$14 U$9.P$15
N$122: R37.2 U$9.P$6 U$9.P$7
N$123: R38.1 U$9.P$4 U$9.P$5
N$124: R35.2 U$9.P$34 U$9.P$35
N$125: R36.1 U$9.P$36 U$9.P$37
N$126: R40.1 U$9.P$26 U$9.P$27
N$127: R39.2 U$9.P$24 U$9.P$25
N$128: K4.13(2:P) U$9.P$22 U$9.P$23
N$130: K3.4(1:P) U$11.P$18 U$11.P$19
N$131: K3.13(2:P) U$11.P$22 U$11.P$23
R+: K1.13(2:P) R5.1
R+OUT: K3.9(2:S) ; also sheet 2
R-: K1.4(1:P) R7.1
R-OUT: K3.8(1:S) ; also sheet 2
RC: R25.1 ; also sheet 3
Unconnected: DSDL+.5(5_1V8) DSDL-.5(5_1V8) DSDR+.5(5_1V8) DSDR-.5(5_1V8) K3.6(1:O) K3.11(2:O) K4.6(1:O) K4.11(2:O) L+.5(5_1V8) L-.5(5_1V8) R+.5(5_1V8) R-.5(5_1V8) U$7.4(4_NC) U$8.4(4_NC) U$17.4(4_NC) U$18.4(4_NC) U$19.4(4_NC) U$20.4(4_NC)

## Library data of the parts
BNC COAX RCAL RCAR = Vwvwbg:RCA
C1-C29 C53-C68 C87 C89-C97 C99 C100 C102-C105 C120-C131 C133-C135 = Vwvwbg:C-EU: CAPACITOR, European symbol
C30-C52 C69 C70 C85 C86 C88 C106-C109 C112-C119 C132 = Vwvwbg:CPOL-EU: POLARIZED CAPACITOR, European symbol
D1-D4 = diode:1N4148: DIODE high speed (Philips)
DSDL+ DSDL- DSDR+ DSDR- L+ L- R+ R- = Vwvwbg:R2R
IC1-IC3 = texas:ISO7240: HIGH SPEED QUAD DIGITAL ISOLATORS Source: http://focus.ti.com/lit/ds/symlink/iso7240m.pdf; MPN: ISO7240MDW; OC_FARNELL: 1755124; OC_NEWARK: 58M0385
IC9-IC13 = texas:ISO7220: DUAL DIGITAL ISOLATORS Source: http://focus.ti.com/lit/ds/symlink/iso7221a.pdf; MPN: ISO7220AD; OC_FARNELL: 1390649; OC_NEWARK: 48M0666
JP1 = SparkFun-Connectors:RJ45-8: RJ45 Jack Simple RJ45, 8-pin connection - connector for common Cat5, Cat5e, and Cat6 Ethernet cables. Footprint not yet proven in production. Connector sku is PRT-00643; Breakout PCB sku is BOB-00716.; PROD_ID: CONN-08506
JP2 = SparkFun-Connectors:M05X2: Header 5x2 Standard 10-pin dual row 0.1" header. Commonly used with AVR-ISP. Use with Spark Fun Electronics SKU: PRT-00778
JP3 = SparkFun-Connectors:M03: Header 3 Standard 3-pin 0.1" header. Use with straight break away headers (SKU : PRT-00116), right angle break away headers (PRT-00553), swiss pins (PRT-00743), machine pins (PRT-00117), and female headers (PRT-00115). Molex polarized connector foot print use with SKU : PRT-08232 with associated crimp pins and housings.
JP4 = SparkFun-Connectors:M05: Header 5 Standard 5-pin 0.1" header. Use with straight break away headers (SKU : PRT-00116), right angle break away headers (PRT-00553), swiss pins (PRT-00743), machine pins (PRT-00117), and female headers (PRT-00115). Molex polarized connector foot print use with SKU : PRT-08230 with associated crimp pins and housings.
K1-K4 = relay:G5V-2: OMRON PCB Relay Source: http://www.omron.com/ecb/products/pdf/en-g5v2.pdf; MPN: G5V-2 5DC; OC_FARNELL: 9949488; OC_NEWARK: 78K5703
PCB1 = E14_Arduino_revB:ARDUINO_NANO: Device for representing an Arduino Nano board with a footprint in an EAGLE design. Created by Dave Young for Element14. More EAGLE documentation at: http://www.element14.com/community/community/knode/cadsoft_eagle
Q1-Q4 = tranzistory NPN:BC550*: NPN Transistor
QG1 QG2 = crystal:XO-: CRYSTAL; OC_FARNELL: unknown; OC_NEWARK: unknown
R1-R8 R13-R42 = Vwvwbg:R-EU_: RESISTOR, European symbol
R9-R12 = resistor:R-TRIMM: Trimm resistor
T1 T2 = transformer-pulse:DAC101C
U1 = Texas Instruments_By_element14_Batch_1:SN74LVC1G125DBVT: Single Bus buffer gate with 3 state output; MPN: SN74LVC1G125DBVT; OC_FARNELL: 1607643; OC_NEWARK: 32H6348; PACKAGE: SOT-23-5; SUPPLIER: Texas Instruments
U$1 = Vwvwbg:COMBO384
U$2 = Vwvwbg:TORX147
U$3 U$4 = maxim:MAX3280E
U$5 U$6 U$13 U$14 U$21 U$22 = Vwvwbg:LME49720
U$7 U$8 U$10 U$15-U$20 = Vwvwbg:LP5907
U$9 U$11 = Vwvwbg:VDACA
U$12 = Vwvwbg:CMOD-A7
X1 X2 = con-neutrik_ag:NC3: Neutrik Audio Connector XLR SERIES Stereo 1/4" jack Source: www.neutrik.com/; MF: NEUTRIK; MPN: NC3MBH; OC_FARNELL: unknown; OC_NEWARK: 91F3470
X3 = con-neutrik_ag:NC4: Neutrik Audio Connector XLR SERIES Stereo 1/4" jack Source: www.neutrik.com/; OC_FARNELL: unknown; OC_NEWARK: unknown
X4 X6 = con-phoenix-508:MKDSN1,5/2-5,08: MKDSN 1,5/ 2-5,08 Printklemme Nennstrom: 13,5 A Nennspannung: 250 V Rastermaß: 5,08 mm Polzahl: 2 Anschlussart: Schraubanschluss Montage: Löten Anschlussrichtung Leiter/Platine: 0 ° Artikelnummer: 1729128 Source: http://eshop.phoenixcontact.com .. 1729128.pdf
X5 = con-phoenix-508:MKDSN1,5/7-5,08: MKDSN 1,5/ 7-5,08 Printklemme Nennstrom: 13,5 A Nennspannung: 250 V Rastermaß: 5,08 mm Polzahl: 7 Anschlussart: Schraubanschluss Montage: Löten Anschlussrichtung Leiter/Platine: 0 ° Artikelnummer: 1729173 Source: http://eshop.phoenixcontact.com .. 1729173.pdf

## Module ADM715X
Ports: 
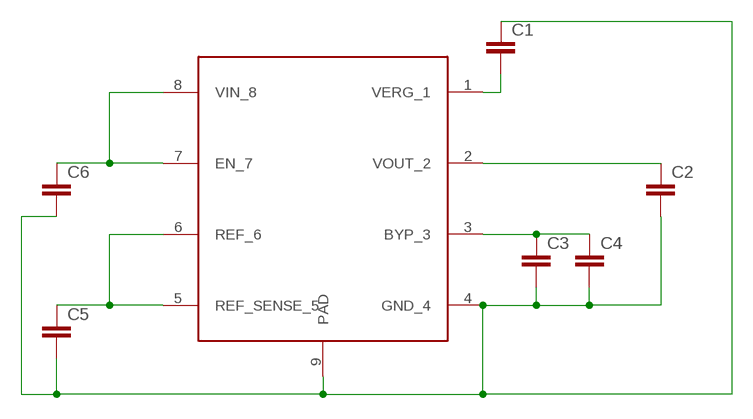
[diagram p5: schematic, module ADM715X, sheet 1]

### Parts
C1  C-EUC1210  [C1210]
C2  C-EUC1210  [C1210]
C3  C-EUC0805  [C0805]
C4  C-EUC0805  [C0805]
C5  C-EUC0805  [C0805]
C6  C-EUC1210  [C1210]
U$1  ADM7150  [SOIC127P600X170-9N]

### Nets
N$1: C6.1 U$1.7(EN_7) U$1.8(VIN_8)
N$2: C5.1 U$1.5(REF_SENSE_5) U$1.6(REF_6)
N$3: C1.1 C2.2 C3.2 C4.2 C5.2 C6.2 U$1.4(GND_4) U$1.9(PAD)
N$4: C3.1 C4.1 U$1.3(BYP_3)
N$5: C2.1 U$1.2(VOUT_2)
N$7: C1.2 U$1.1(VERG_1)

### Library data of the parts
C1-C6 = Vwvwbg:C-EU: CAPACITOR, European symbol
U$1 = Texas Instruments_By_element14_Batch_1:ADM7150